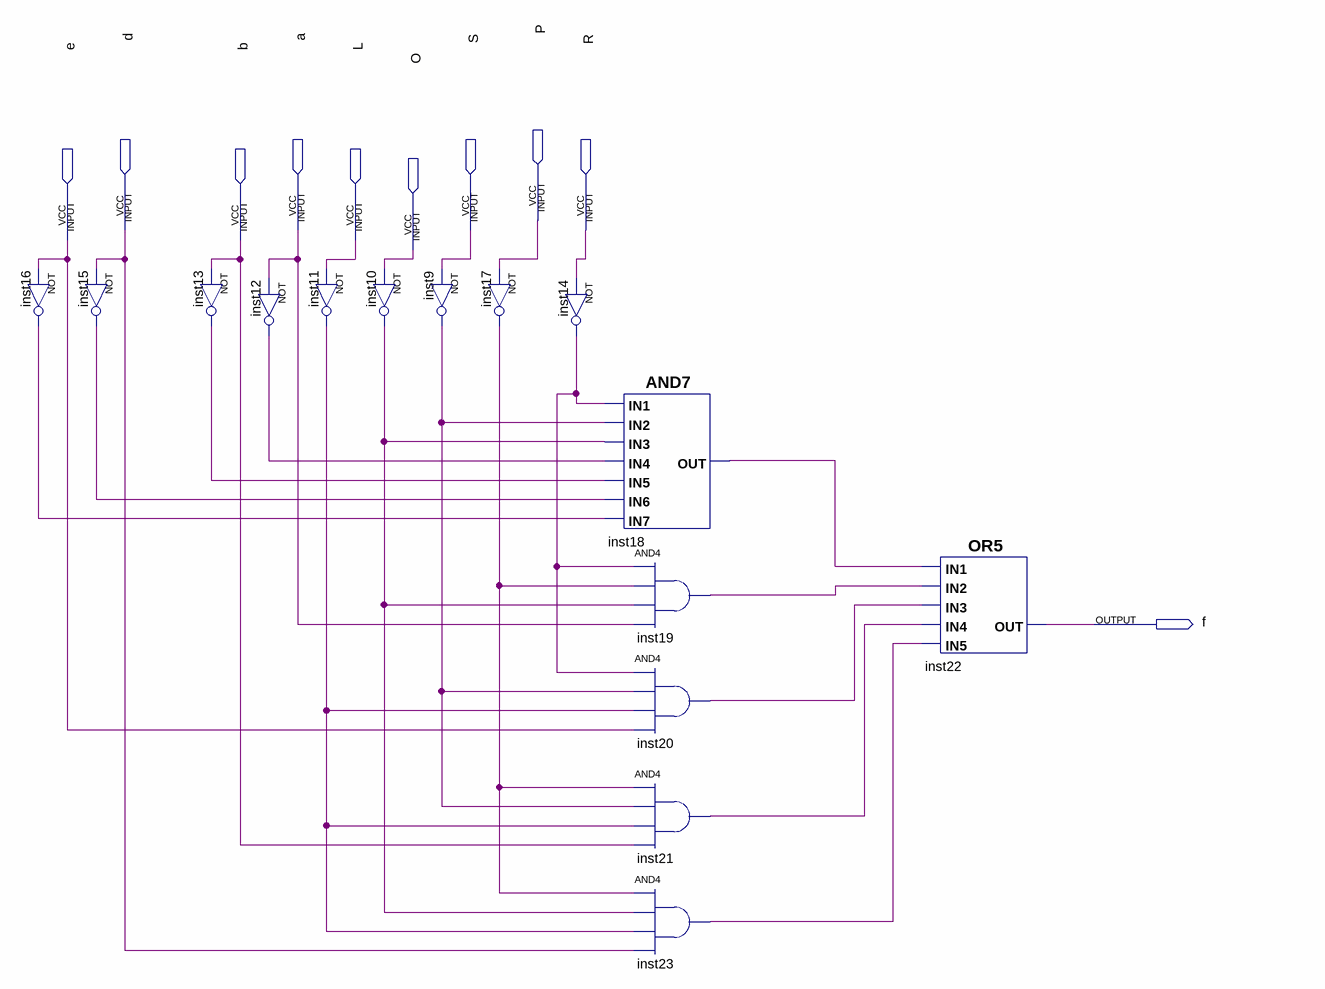
[diagram p0: schematic sheet]
// Quartus schematic a.bdf as structural Verilog: 15 symbols, 10 pins
module a (
  input  P,
  input  d,
  input  a,
  input  S,
  input  R,
  input  e,
  input  b,
  input  L,
  input  O,
  output f
);

  wire inst9_out, inst10_out, inst11_out, inst12_out, inst13_out, inst14_out, inst15_out, inst16_out,
       inst17_out, inst18_out, inst19_out, inst20_out, inst21_out, inst23_out;

  not inst16 (inst16_out, e);
  not inst15 (inst15_out, d);
  not inst13 (inst13_out, b);
  not inst12 (inst12_out, a);
  not inst10 (inst10_out, O);
  not inst11 (inst11_out, L);
  not inst9 (inst9_out, S);
  not inst17 (inst17_out, P);
  not inst14 (inst14_out, R);
  and inst18 (inst18_out, inst14_out, inst9_out, inst10_out, inst12_out, inst13_out, inst15_out, inst16_out);
  and inst19 (inst19_out, inst14_out, inst17_out, inst10_out, a);
  and inst20 (inst20_out, inst14_out, inst9_out, inst11_out, e);
  and inst21 (inst21_out, inst17_out, inst9_out, inst11_out, b);
  and inst23 (inst23_out, inst17_out, inst10_out, inst11_out, d);
  or inst22 (f, inst18_out, inst19_out, inst20_out, inst21_out, inst23_out);
endmodule
